# EAGLE design IOBoard (EAGLE 7.5.0)
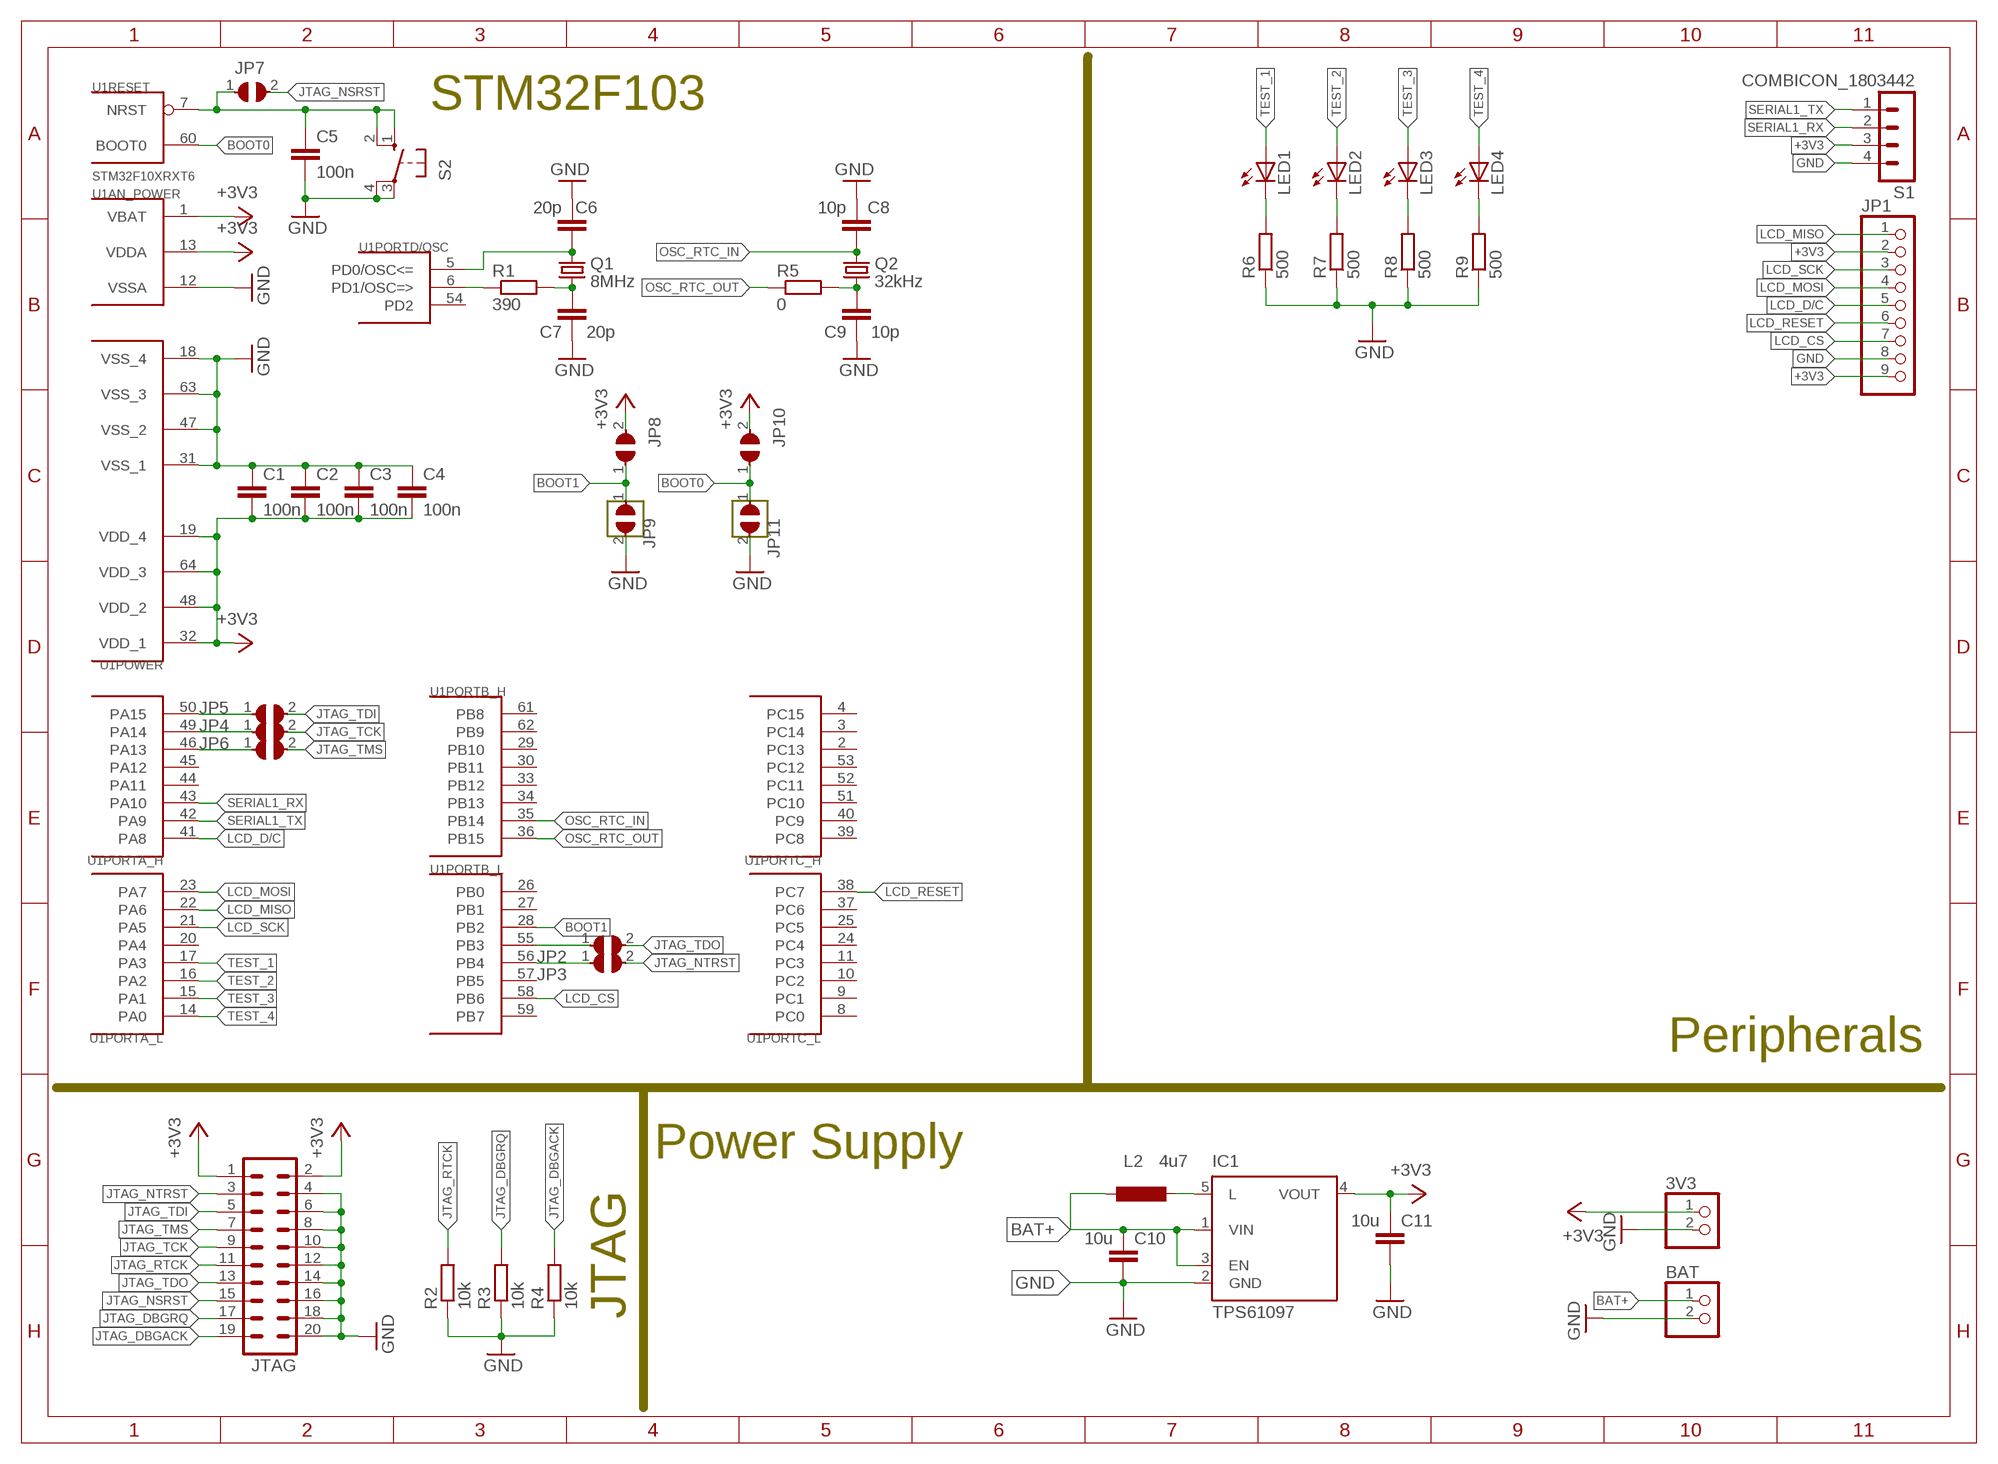
[diagram p0: schematic, sheet 1]

## Parts
3V3  PINHD-1X2  [1X02]
BAT  PINHD-1X2  [1X02]
C1  100n  C-EUC0805  [C0805]
C2  100n  C-EUC0805  [C0805]
C3  100n  C-EUC0805  [C0805]
C4  100n  C-EUC0805  [C0805]
C5  100n  C-EUC0805  [C0805]
C6  20p  C-EUC0805  [C0805]
C7  20p  C-EUC0805  [C0805]
C8  10p  C-EUC0805  [C0805]
C9  10p  C-EUC0805  [C0805]
C10  10u  C-EUC0805  [C0805]
C11  10u  C-EUC0805  [C0805]
IC1  TPS61097  [SOT23-DBV]
JP1  PINHD-1X9  [1X09]
JP2  JUMPER_SMALL  [JUMPER]
JP3  JUMPER_SMALL  [JUMPER]
JP4  JUMPER_SMALL  [JUMPER]
JP5  JUMPER_SMALL  [JUMPER]
JP6  JUMPER_SMALL  [JUMPER]
JP7  JUMPER_SMALL  [JUMPER]
JP8  JUMPER_SMALL  [JUMPER]
JP9  JUMPER_SMALL  [JUMPER]
JP10  JUMPER_SMALL  [JUMPER]
JP11  JUMPER_SMALL  [JUMPER]
JTAG  ML20  [ML20]
L2  4u7  INDUCTOR_2520  [INDC6350X200N]
LED1  LEDSML0603  [SML0603]
LED2  LEDSML0603  [SML0603]
LED3  LEDSML0603  [SML0603]
LED4  LEDSML0603  [SML0603]
Q1  8MHz  CSM-7X-DU  [CSM-7X-DU]
Q2  32kHz  MC-306  [MC-306]
R1  390  R-EU_R0805  [R0805]
R2  10k  R-EU_R0805  [R0805]
R3  10k  R-EU_R0805  [R0805]
R4  10k  R-EU_R0805  [R0805]
R5  0  R-EU_R0805  [R0805]
R6  500  R-EU_R0805  [R0805]
R7  500  R-EU_R0805  [R0805]
R8  500  R-EU_R0805  [R0805]
R9  500  R-EU_R0805  [R0805]
S1  COMBICON_1803442  [COMBICON_1803442]
S2  10-XX  [B3F-10XX]
U1  STM32F10XRXT6  [TQFP64]

## Nets
+3V3: 3V3.1 C1.2 C2.2 C3.2 C4.2 C11.2 IC1.4(VOUT) JP1.2 JP1.9 JP8.2 JP10.2 JTAG.1 JTAG.2 S1.3 U1.1(AN_POWER:VBAT) U1.13(AN_POWER:VDDA) U1.19(POWER:VDD_4) U1.32(POWER:VDD_1) U1.48(POWER:VDD_2) U1.64(POWER:VDD_3)
BAT+: BAT.1 C10.2 IC1.1(VIN) IC1.3(EN) L2.1
BOOT0: JP10.1 JP11.1 U1.60(RESET:BOOT0)
BOOT1: JP8.1 JP9.1 U1.28(PORTB_L:PB2)
GND: 3V3.2 BAT.2 C1.1 C2.1 C3.1 C4.1 C5.2 C6.2 C7.1 C8.2 C9.1 C10.1 C11.1 IC1.2(GND) JP1.8 JP9.2 JP11.2 JTAG.4 JTAG.6 JTAG.8 JTAG.10 JTAG.12 JTAG.14 JTAG.16 JTAG.18 JTAG.20 R2.1 R3.1 R4.1 R6.1 R7.1 R8.1 R9.1 S1.4 S2.3(P) S2.4(P1) U1.12(AN_POWER:VSSA) U1.18(POWER:VSS_4) U1.31(POWER:VSS_1) U1.47(POWER:VSS_2) U1.63(POWER:VSS_3)
JTAG_DBGACK: JTAG.19 R4.2
JTAG_DBGRQ: JTAG.17 R3.2
JTAG_NSRST: JP7.2 JTAG.15
JTAG_NTRST: JP3.2 JTAG.3
JTAG_RTCK: JTAG.11 R2.2
JTAG_TCK: JP4.2 JTAG.9
JTAG_TDI: JP5.2 JTAG.5
JTAG_TDO: JP2.2 JTAG.13
JTAG_TMS: JP6.2 JTAG.7
LCD_CS: JP1.7 U1.58(PORTB_L:PB6)
LCD_D/C: JP1.5 U1.41(PORTA_H:PA8)
LCD_MISO: JP1.1 U1.22(PORTA_L:PA6)
LCD_MOSI: JP1.4 U1.23(PORTA_L:PA7)
LCD_RESET: JP1.6 U1.38(PORTC_L:PC7)
LCD_SCK: JP1.3 U1.21(PORTA_L:PA5)
N$1: C5.1 JP7.1 S2.1(S) S2.2(S1) U1.7(RESET:NRST)
N$2: C6.1 Q1.2 U1.5(PORTD/OSC:PD0/OSC<=)
N$3: R1.1 U1.6(PORTD/OSC:PD1/OSC=>)
N$4: JP2.1 U1.55(PORTB_L:PB3)
N$5: C7.2 Q1.1 R1.2
N$6: JP4.1 U1.49(PORTA_H:PA14)
N$7: JP6.1 U1.46(PORTA_H:PA13)
N$8: JP5.1 U1.50(PORTA_H:PA15)
N$9: JP3.1 U1.56(PORTB_L:PB4)
N$10: C9.2 Q2.1 R5.2
N$11: LED1.C R6.2
N$12: LED2.C R7.2
N$13: LED3.C R8.2
N$14: LED4.C R9.2
N$15: IC1.5(L) L2.2
OSC_RTC_IN: C8.1 Q2.4 U1.35(PORTB_H:PB14)
OSC_RTC_OUT: R5.1 U1.36(PORTB_H:PB15)
SERIAL1_RX: S1.2 U1.43(PORTA_H:PA10)
SERIAL1_TX: S1.1 U1.42(PORTA_H:PA9)
TEST_1: LED1.A U1.17(PORTA_L:PA3)
TEST_2: LED2.A U1.16(PORTA_L:PA2)
TEST_3: LED3.A U1.15(PORTA_L:PA1)
TEST_4: LED4.A U1.14(PORTA_L:PA0)
Unconnected: U1.2(PORTC_H:PC13) U1.3(PORTC_H:PC14) U1.4(PORTC_H:PC15) U1.8(PORTC_L:PC0) U1.9(PORTC_L:PC1) U1.10(PORTC_L:PC2) U1.11(PORTC_L:PC3) U1.20(PORTA_L:PA4) U1.24(PORTC_L:PC4) U1.25(PORTC_L:PC5) U1.26(PORTB_L:PB0) U1.27(PORTB_L:PB1) U1.29(PORTB_H:PB10) U1.30(PORTB_H:PB11) U1.33(PORTB_H:PB12) U1.34(PORTB_H:PB13) U1.37(PORTC_L:PC6) U1.39(PORTC_H:PC8) U1.40(PORTC_H:PC9) U1.44(PORTA_H:PA11) U1.45(PORTA_H:PA12) U1.51(PORTC_H:PC10) U1.52(PORTC_H:PC11) U1.53(PORTC_H:PC12) U1.54(PORTD/OSC:PD2) U1.57(PORTB_L:PB5) U1.59(PORTB_L:PB7) U1.61(PORTB_H:PB8) U1.62(PORTB_H:PB9)

## Notes on the sheet
- STM32F103
- Peripherals
- Power Supply
- JTAG

## Library data of the parts
3V3 BAT = pinhead:PINHD-1X2: PIN HEADER
C1-C11 = rcl:C-EU: CAPACITOR, European symbol
IC1 = spfennig:TPS61097
JP1 = pinhead:PINHD-1X9: PIN HEADER
JP2-JP11 = memmert_joerg:JUMPER
JTAG = con-harting-ml:ML20: HARTING; OC_FARNELL: unknown; OC_NEWARK: unknown
L2 = ipc-7351-inductor:INDUCTOR_
LED1-LED4 = led:LED: LED OSRAM: - CHIPLED LG R971, LG N971, LY N971, LG Q971, LY Q971, LO R971, LY R971 LH N974, LH R974 LS Q976, LO Q976, LY Q976 LO Q996 - Hyper CHIPLED LW Q18S LB Q993, LB Q99A, LB R99A - SideLED LS A670, LO A670, LY A670, LG A670, LP A670 LB A673, LV A673, LT A673, LW A673 LH A674 LY A675 LS A676, LA A676, LO A676, LY A676, LW A676 LS A679, LY A679, LG A679 - Hyper Micro SIDELED® LS Y876, LA Y876, LO Y876, LY Y876 LT Y87S - SmartLED LW L88C, LW L88S LB L89C, LB L89S, LG L890 LS L89K, LO L89K, LY L89K LS L896, LA L896, LO L896, LY L896 - TOPLED LS T670, LO T670, LY T670, LG T670, LP T670 LSG T670, LSP T670, LSY T670, LOP T670, LYG T670 LG T671, LOG T671, LSG T671 LB T673, LV T673, LT T673, LW T673 LH T674 LS T676, LA T676, LO T676, LY T676, LB T676, LH T676, LSB T676, LW T676 LB T67C, LV T67C, LT T67C, LS T67K, LO T67K, LY T67K, LW E67C LS E67B, LA E67B, LO E67B, LY E67B, LB E67C, LV E67C, LT E67C LW T67C LS T679, LY T679, LG T679 LS T770, LO T770, LY T770, LG T770, LP T770 LB T773, LV T773, LT T773, LW T773 LH T774 LS E675, LA E675, LY E675, LS T675 LS T776, LA T776, LO T776, LY T776, LB T776 LHGB T686 LT T68C, LB T68C - Hyper Mini TOPLED® LB M676 - Mini TOPLED Santana® LG M470 LS M47K, LO M47K, LY M47K Source: http://www.osram.convergy.de LUXEON: - LUMILED® LXK2-PW12-R00, LXK2-PW12-S00, LXK2-PW14-U00, LXK2-PW14-V00 LXK2-PM12-R00, LXK2-PM12-S00, LXK2-PM14-U00 LXK2-PE12-Q00, LXK2-PE12-R00, LXK2-PE12-S00, LXK2-PE14-T00, LXK2-PE14-U00 LXK2-PB12-K00, LXK2-PB12-L00, LXK2-PB12-M00, LXK2-PB14-N00, LXK2-PB14-P00, LXK2-PB14-Q00 LXK2-PR12-L00, LXK2-PR12-M00, LXK2-PR14-Q00, LXK2-PR14-R00 LXK2-PD12-Q00, LXK2-PD12-R00, LXK2-PD12-S00 LXK2-PH12-R00, LXK2-PH12-S00 LXK2-PL12-P00, LXK2-PL12-Q00, LXK2-PL12-R00 Source: www.luxeon.com KINGBRIGHT: KA-3528ASYC Source: www.kingbright.com
Q1 = crystal:CSM-7X-DU: SMD CRYSTAL Source: www.ecsxtal.com .. Crystal 3.6864MHz CSM_7X_DU.PDF; OC_FARNELL: unknown; OC_NEWARK: unknown
Q2 = crystal:MC-306: kHz RANGE CRYSTAL UNIT SMD Source: MC-306_405_406_E07X.PDF Homepage <http://www.epsontoyocom.co.jp>; MPN: MC-306 60.0KHZ 100PPM ,12.5PF; OC_FARNELL: 1278040; OC_NEWARK: 31M5576
R1-R9 = rcl:R-EU_: RESISTOR, European symbol
S1 = memmert_joerg:COMBICON_1803442
S2 = switch-omron:10-XX: OMRON SWITCH; MPN: B3F-1000; OC_FARNELL: 176432; OC_NEWARK: 36M3542
U1 = stm32:STM32F10XRXT6: STM32F101/103 64pin LQFP

## Net classes
0 default: width 0.2 mm, drill 0.4 mm, clearance 0.2 mm

## Board
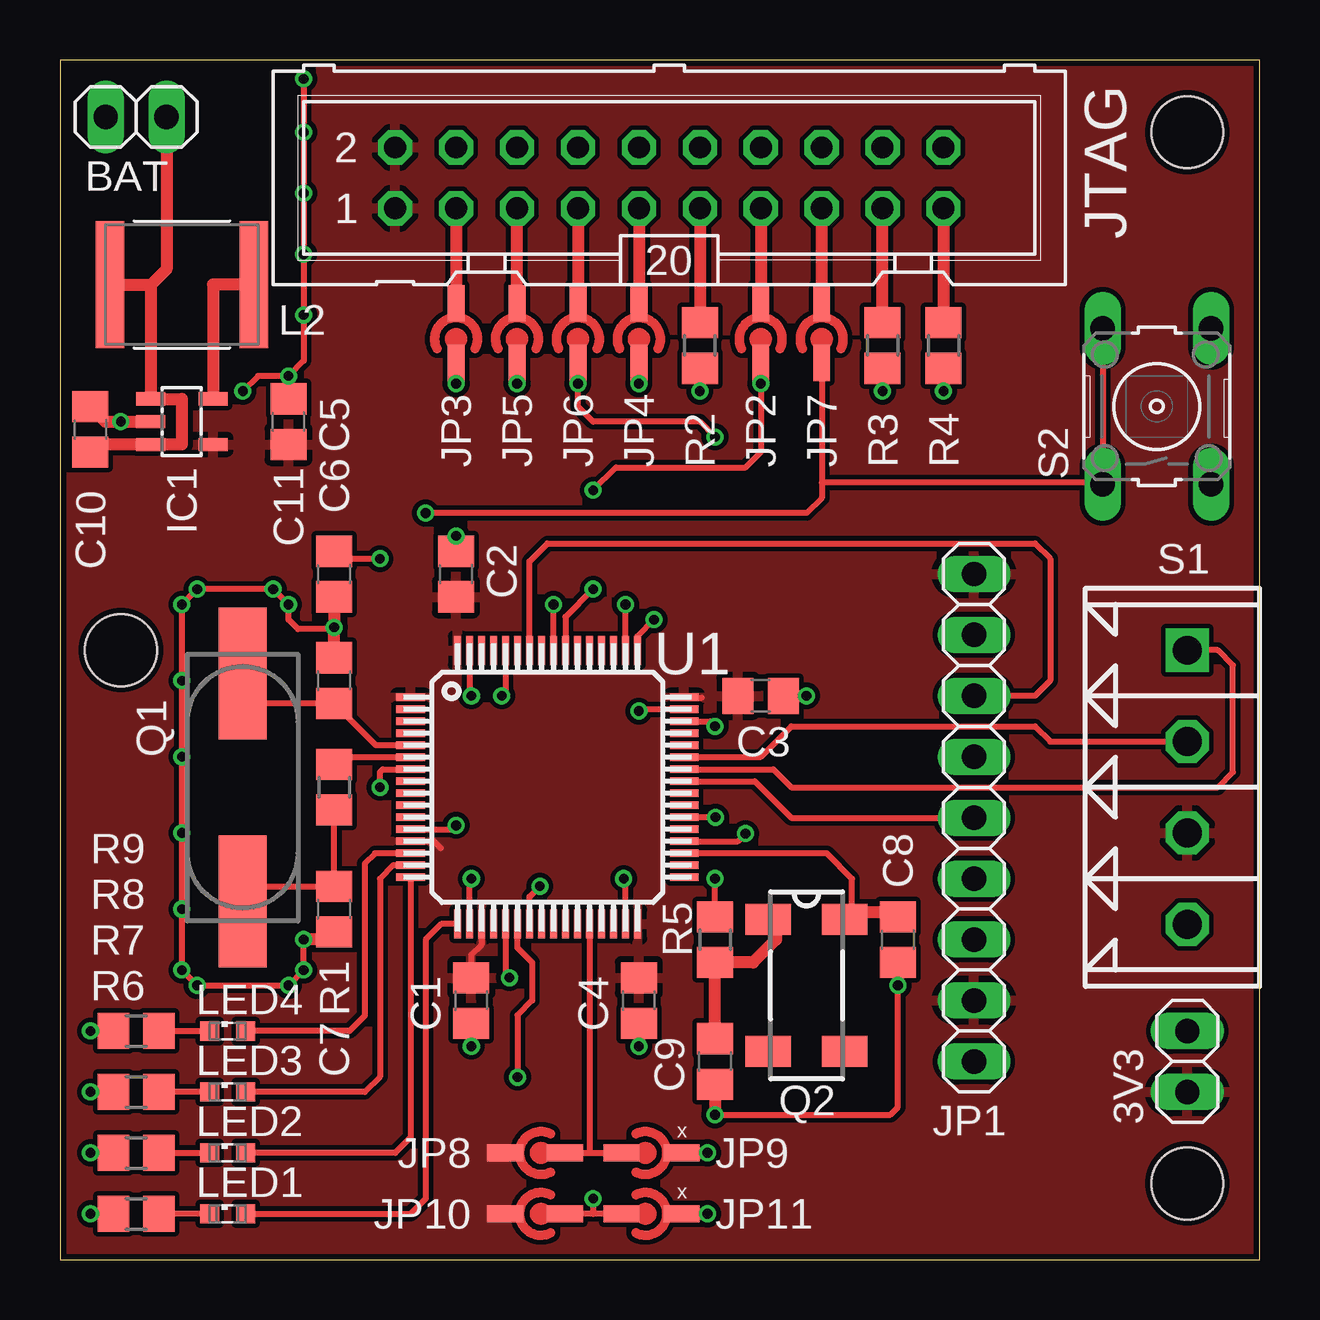
[diagram p1: board, top side]
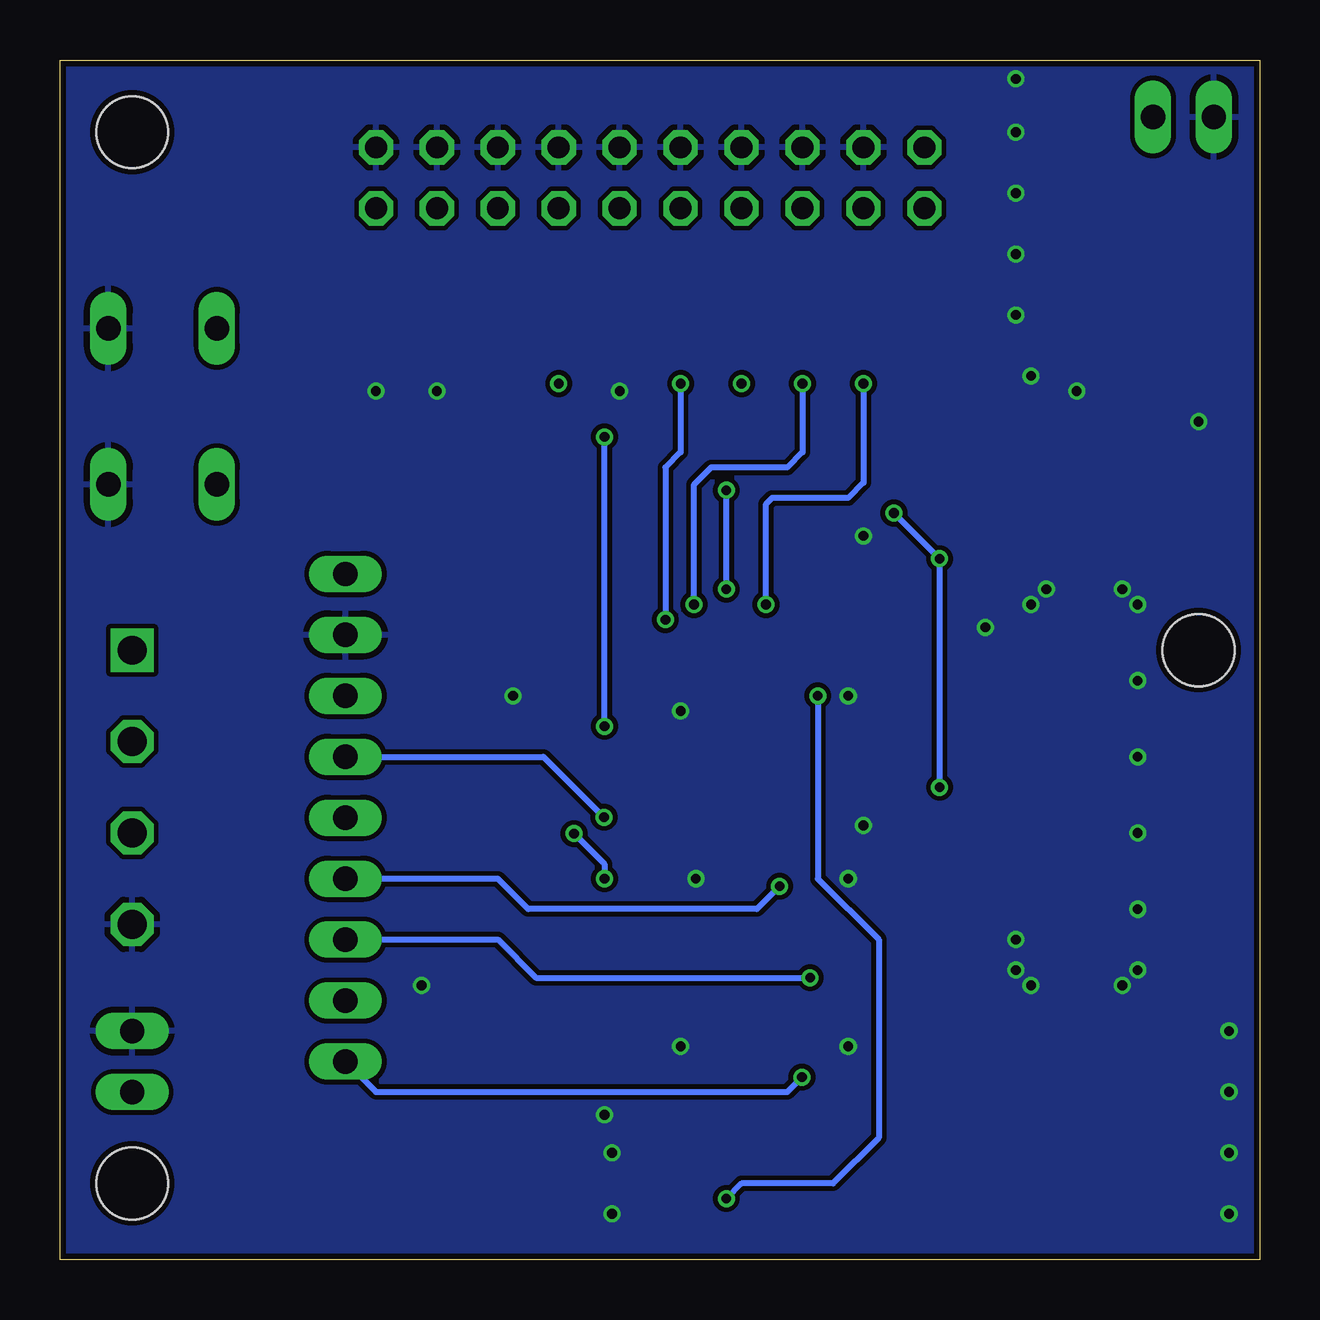
[diagram p2: board, bottom side, seen from below]

Size 50 x 50 mm. Coordinates in mm from the lower left corner, seen from the top.
Outline: 0,0 50,0 50,50 0,50 0,0
Copper layers (1*16): Top 0.035mm / dielectric 1.5mm / Bottom 0.035mm
Design rules "ITead_rule *": minimum track width 6mil, minimum drill 12mil, track to track 6mil, track to pad 6mil, pad to pad 6mil, via to via 6mil, smd to smd 0mil, copper to edge 10mil, drill to drill 10mil, minimum pad ring 10mil, minimum via ring 6mil, stop-mask expansion 2mil, vias tented up to drill 100mil, thermal gap 10mil
Holes 3 mm at 46.99,46.99 46.99,3.17 2.54,25.4

### Footprints (pad centres in the part's own frame; a part is rotated, then mirrored left to right if it is on the bottom)
1X02 = drill 1.016 long: 1 -1.27,0; 2 1.27,0
C0805 = smd 1.3 x 1.5: 1 -0.95,0; 2 0.95,0
SOT23-DBV = smd 0.55 x 1.2: 1 -0.95,-1.3; 2 0,-1.3; 3 0.95,-1.3; 4 0.95,1.3; 5 -0.95,1.3
1X09 = drill 1.016 long: 1 -10.16,0; 2 -7.62,0; 3 -5.08,0; 4 -2.54,0; 5 0,0; 6 2.54,0; 7 5.08,0; 8 7.62,0; 9 10.16,0
JUMPER = smd 1.5 x 0.7: 1 -2,0; 2 0.5,0
ML20 = drill 0.914 octagon: 1 -11.43,-1.27; 2 -11.43,1.27; 3 -8.89,-1.27; 4 -8.89,1.27; 5 -6.35,-1.27; 6 -6.35,1.27; 7 -3.81,-1.27; 8 -3.81,1.27; 9 -1.27,-1.27; 10 -1.27,1.27; 11 1.27,-1.27; 12 1.27,1.27; 13 3.81,-1.27; 14 3.81,1.27; 15 6.35,-1.27; 16 6.35,1.27; 17 8.89,-1.27; 18 8.89,1.27; 19 11.43,-1.27; 20 11.43,1.27
INDC6350X200N = smd 1.2 x 5.3: 1 -3,0; 2 3,0
SML0603 = smd 0.8 x 0.8: A 0.75,0; C -0.75,0
CSM-7X-DU = smd 5.5 x 2: 1 -4.75,0; 2 4.75,0
MC-306 = smd 1.3 x 1.9: 1 -2.75,-1.6; 2 2.75,-1.6; 3 2.75,1.6; 4 -2.75,1.6
R0805 = smd 1.3 x 1.5: 1 -0.95,0; 2 0.95,0
COMBICON_1803442 = drill 1.2 pad 1.7 square: 1 -5.715,0 | drill 1.2 pad 1.7 octagon: 2 -1.905,0; 3 1.905,0; 4 5.715,0
B3F-10XX = drill 1.016 long: 1 -3.251,2.261; 2 3.251,2.261; 3 -3.251,-2.261; 4 3.251,-2.261
TQFP64 = smd 1.2 x 0.3: 1 -5.7,3.75; 2 -5.7,3.25; 3 -5.7,2.75; 4 -5.7,2.25; 5 -5.7,1.75; 6 -5.7,1.25; 7 -5.7,0.75; 8 -5.7,0.25; 9 -5.7,-0.25; 10 -5.7,-0.75; 11 -5.7,-1.25; 12 -5.7,-1.75; 13 -5.7,-2.25; 14 -5.7,-2.75; 15 -5.7,-3.25; 16 -5.7,-3.75; 33 5.7,-3.75; 34 5.7,-3.25; 35 5.7,-2.75; 36 5.7,-2.25; 37 5.7,-1.75; 38 5.7,-1.25; 39 5.7,-0.75; 40 5.7,-0.25; 41 5.7,0.25; 42 5.7,0.75; 43 5.7,1.25; 44 5.7,1.75; 45 5.7,2.25; 46 5.7,2.75; 47 5.7,3.25; 48 5.7,3.75 | smd 0.3 x 1.2: 17 -3.75,-5.7; 18 -3.25,-5.7; 19 -2.75,-5.7; 20 -2.25,-5.7; 21 -1.75,-5.7; 22 -1.25,-5.7; 23 -0.75,-5.7; 24 -0.25,-5.7; 25 0.25,-5.7; 26 0.75,-5.7; 27 1.25,-5.7; 28 1.75,-5.7; 29 2.25,-5.7; 30 2.75,-5.7; 31 3.25,-5.7; 32 3.75,-5.7; 49 3.75,5.7; 50 3.25,5.7; 51 2.75,5.7; 52 2.25,5.7; 53 1.75,5.7; 54 1.25,5.7; 55 0.75,5.7; 56 0.25,5.7; 57 -0.25,5.7; 58 -0.75,5.7; 59 -1.25,5.7; 60 -1.75,5.7; 61 -2.25,5.7; 62 -2.75,5.7; 63 -3.25,5.7; 64 -3.75,5.7

### Placement (x,y rotation side)
3V3  46.99,8.26 90 top
BAT  3.17,47.62 180 top
C1  17.14,10.79 90 top
C2  16.51,28.57 270 top
C3  29.21,23.5 180 top
C4  24.13,10.79 90 top
C5  11.43,28.57 270 top
C6  11.43,24.13 90 top
C7  11.43,14.61 90 top
C8  34.92,13.34 270 top
C9  27.3,8.26 90 top
C10  1.27,34.61 270 top
C11  9.53,34.92 270 top
IC1  5.08,34.92 270 top
JP1  38.1,18.41 90 top
JP2  29.21,39.37 90 top
JP3  16.51,39.37 90 top
JP4  24.13,39.37 90 top
JP5  19.05,39.37 90 top
JP6  21.59,39.37 90 top
JP7  31.75,39.37 90 top
JP8  19.05,4.45 180 top
JP9  25.4,4.45 0 top
JP10  19.05,1.91 180 top
JP11  25.4,1.91 0 top
JTAG  25.4,45.09 0 top
L2  5.08,40.64 0 top
LED1  6.99,1.91 0 top
LED2  6.99,4.45 0 top
LED3  6.99,6.99 0 top
LED4  6.99,9.53 0 top
Q1  7.62,19.68 90 top
Q2  31.11,11.43 270 top
R1  11.43,19.68 270 top
R2  26.67,38.1 90 top
R3  34.29,38.1 90 top
R4  36.83,38.1 90 top
R5  27.3,13.34 270 top
R6  3.17,1.91 0 top
R7  3.17,4.45 0 top
R8  3.17,6.99 0 top
R9  3.17,9.53 0 top
S1  46.99,19.68 270 top
S2  45.72,35.56 90 top
U1  20.32,19.68 0 top

### Tracks (layer width: path | path; a pad name or v marks a point on that pad's centre or on a via)
+3V3
  Top 0.254: U1.19 17.57,13.12 17.14,12.7 C1.2 | U1.13 15.59,17.43 15.88,17.14 | 26.75,23.42 26.51,23.42 26.49,23.43 U1.48
  pour Top: 0,50.16 50.16,50.16 50.16,0 0,0
BAT+
  Top 0.508: L2.1 3.78,40.64 | 3.78,40.64 IC1.1 5.08,35.88 5.08,33.98 IC1.3 1.59,33.98 arc90 C10.2 | BAT.1 4.45,41.27 3.81,40.64 3.78,40.64
BOOT0  (via drill 0.41)
  Top 0.254: JP11.1 22.23,1.91 | 22.23,1.91 JP10.1 | U1.60 18.57,23.65 v18.41,23.5 | v22.23,2.54 22.23,1.91
  Bottom 0.254: v18.41,23.5 18.41,15.88 15.88,13.34 15.88,5.08 17.78,3.17 21.59,3.17 v22.23,2.54
BOOT1
  Top 0.254: JP8.1 22.07,4.45 | 22.07,4.45 JP9.1 | U1.28 22.07,4.45
GND  (via drill 0.41)
  Top 0.254: C7.1 11.43,13.34 | C6.2 11.43,24.77 | U1.63 17.07,23.57 v17.14,23.5 | U1.47 24.2,22.93 v24.13,22.86 | U1.18 17.07,15.8 v17.14,15.88 | U1.31 23.57,15.8 v23.5,15.88 | U1.12 16.35,17.93 v16.51,18.1 | 11.35,26.27 9.92,26.27 9.53,26.67 v9.53,27.3 v8.89,27.94 v5.71,27.94 v5.08,27.3 v5.08,24.13 v5.08,20.95 v5.08,17.78 v5.08,14.61 v5.08,12.06 v5.71,11.43 v9.53,11.43 v10.16,12.06 v10.16,13.34 | v10.16,49.21 v10.16,46.99 v10.16,44.45 v10.16,41.91 v10.16,39.37 10.16,37.47 v9.53,36.83 8.26,36.83 v7.62,36.2 | v27.3,6.03 34.61,6.03 34.92,6.35 v34.92,11.43
  Top 0.508: 11.43,13.34 v10.16,13.34 | 11.43,24.77 v11.43,26.35 C5.2 | C2.1 v16.51,30.16 | C3.1 v31.11,23.5 | C4.1 v24.13,8.89 | C1.1 v17.14,8.89 | R3.1 v34.29,36.2 | R4.1 v36.83,36.2 | R2.1 v26.67,36.2 | C9.1 v27.3,6.03 | C8.2 v34.92,11.43 | R9.1 v1.27,9.53 | R8.1 v1.27,6.99 | R7.1 v1.27,4.45 | R6.1 v1.27,1.91 | JP9.2 v26.99,4.45 | JP11.2 v26.99,1.91 | C11.1 v9.53,36.83 | C10.1 1.9,34.92 v2.54,34.92 IC1.2
  pour Bottom: 0,0 50.16,0 50.16,50.16 0,50.16
JTAG_DBGACK
  Top 0.508: JTAG.19 R4.2
JTAG_DBGRQ
  Top 0.508: R3.2 JTAG.17
JTAG_NSRST
  Top 0.508: JP7.2 JTAG.15
JTAG_NTRST
  Top 0.508: JTAG.3 JP3.2
JTAG_RTCK
  Top 0.508: JTAG.11 R2.2
JTAG_TCK
  Top 0.508: JTAG.9 JP4.2
JTAG_TDI
  Top 0.508: JP5.2 JTAG.5
JTAG_TDO
  Top 0.508: JTAG.13 JP2.2
JTAG_TMS
  Top 0.508: JTAG.7 JP6.2
LCD_CS
  Top 0.254: U1.58 19.57,29.09 20.32,29.84 40.64,29.84 41.27,29.21 41.27,24.13 40.64,23.5 JP1.7
LCD_D/C
  Top 0.254: U1.41 28.96,19.93 30.48,18.41 JP1.5
LCD_MISO  (via drill 0.41)
  Top 0.254: U1.22 19.07,13 19.68,12.38 19.68,10.79 19.07,10.18 v19.07,7.6
  Bottom 0.254: JP1.1 36.83,6.99 19.68,6.99 v19.07,7.6
LCD_MOSI  (via drill 0.41)
  Top 0.254: U1.23 19.57,15.12 v20,15.56
  Bottom 0.254: v20,15.56 20.95,14.61 30.48,14.61 31.75,15.88 JP1.4
LCD_RESET  (via drill 0.41)
  Top 0.254: v27.32,18.43 U1.38
  Bottom 0.254: JP1.6 29.84,20.95 v27.32,18.43
LCD_SCK  (via drill 0.41)
  Top 0.254: U1.21 18.57,11.91 v18.73,11.75
  Bottom 0.254: JP1.3 31.75,13.34 30.16,11.75 v18.73,11.75
N$1  (via drill 0.41)
  Top 0.254: JP7.1 31.75,32.38 | 31.75,32.38 31.75,31.75 31.11,31.11 v15.24,31.11 | C5.1 11.74,29.21 v13.34,29.21 | v13.34,19.68 13.34,20.32 13.45,20.43 U1.7 | S2.2 S2.1 43.38,32.38 31.75,32.38
  Bottom 0.254: v15.24,31.11 v13.34,29.21 v13.34,19.68
N$2
  Top 0.254: Q1.2 7.63,24.45 7.63,23.5 | 7.63,23.5 7.63,22.55 | 7.63,23.5 7.95,23.18 C6.1 13.18,21.43 U1.5
N$3
  Top 0.254: U1.6 11.73,20.93 R1.1
N$4  (via drill 0.41)
  Top 0.254: JP2.1 v29.21,36.51 29.21,33.66 28.57,33.02 23.18,33.02 v22.23,32.07 | U1.55 21.07,26.79 v22.23,27.94
  Bottom 0.254: v22.23,27.94 v22.23,32.07
N$5
  Top 0.254: Q1.1 7.62,15.55 C7.2 R1.2
N$6  (via drill 0.41)
  Top 0.254: JP4.1 v24.13,36.51 | v24.77,26.67 24.07,25.98 U1.49
  Bottom 0.254: v24.13,36.51 24.13,33.66 24.77,33.02 v24.77,26.67
N$7  (via drill 0.41)
  Top 0.254: JP6.1 v21.59,36.51 21.59,35.56 22.23,34.92 26.67,34.92 v27.3,34.29 | U1.46 27.09,22.43 v27.3,22.23
  Bottom 0.254: v27.3,22.23 v27.3,34.29
N$8  (via drill 0.41)
  Top 0.254: JP5.1 v19.05,36.51 | U1.50 v23.57,27.3
  Bottom 0.254: v19.05,36.51 19.05,33.66 19.68,33.02 22.86,33.02 23.57,32.31 v23.57,27.3
N$9  (via drill 0.41)
  Top 0.254: JP3.1 v16.51,36.51 | U1.56 v20.57,27.3
  Bottom 0.254: v16.51,36.51 16.51,32.38 17.14,31.75 20.32,31.75 20.57,31.5 v20.57,27.3
N$10
  Top 0.508: Q2.1 29.84,13.85 29.84,13.34 28.89,12.38 R5.2 C9.2
N$11
  Top 0.254: LED1.C R6.2
N$12
  Top 0.254: R7.2 LED2.C
N$13
  Top 0.254: LED3.C R8.2
N$14
  Top 0.254: R9.2 LED4.C
N$15
  Top 0.508: L2.2 6.38,40.64 IC1.5
OSC_RTC_IN
  Top 0.254: Q2.4 33.02,14.48 33.02,15.88 31.96,16.93 U1.35
  Top 0.508: 33.02,14.48 34.73,14.48 C8.1
OSC_RTC_OUT  (via drill 0.41)
  Top 0.254: R5.1 v27.3,15.88 | U1.36 28.26,17.43 v28.57,17.75
  Bottom 0.254: v28.57,17.75 27.3,16.48 v27.3,15.88
SERIAL1_RX
  Top 0.254: U1.43 26.04,20.95 29.21,20.95 30.48,22.23 40.64,22.23 41.27,21.59 S1.2
SERIAL1_TX
  Top 0.254: U1.42 29.73,20.43 30.48,19.68 48.26,19.68 48.9,20.32 48.9,24.77 48.26,25.4 S1.1
TEST_1
  Top 0.254: U1.17 15.89,13.98 15.24,13.34 15.24,2.54 14.61,1.91 LED1.A
TEST_2
  Top 0.254: U1.16 14.62,5.09 13.97,4.45 LED2.A
TEST_3
  Top 0.254: U1.15 13.89,16.43 13.34,15.88 13.34,7.62 12.7,6.99 LED3.A
TEST_4
  Top 0.254: U1.14 13.12,16.93 12.7,16.51 12.7,10.16 12.06,9.53 LED4.A

### Text on the board
tPlace: x | x